# EAGLE design Venus (EAGLE 9.6.2)
COMPANY: ADAFRUIT INDUSTRIES; DRAWN: KTOWN; REV: B
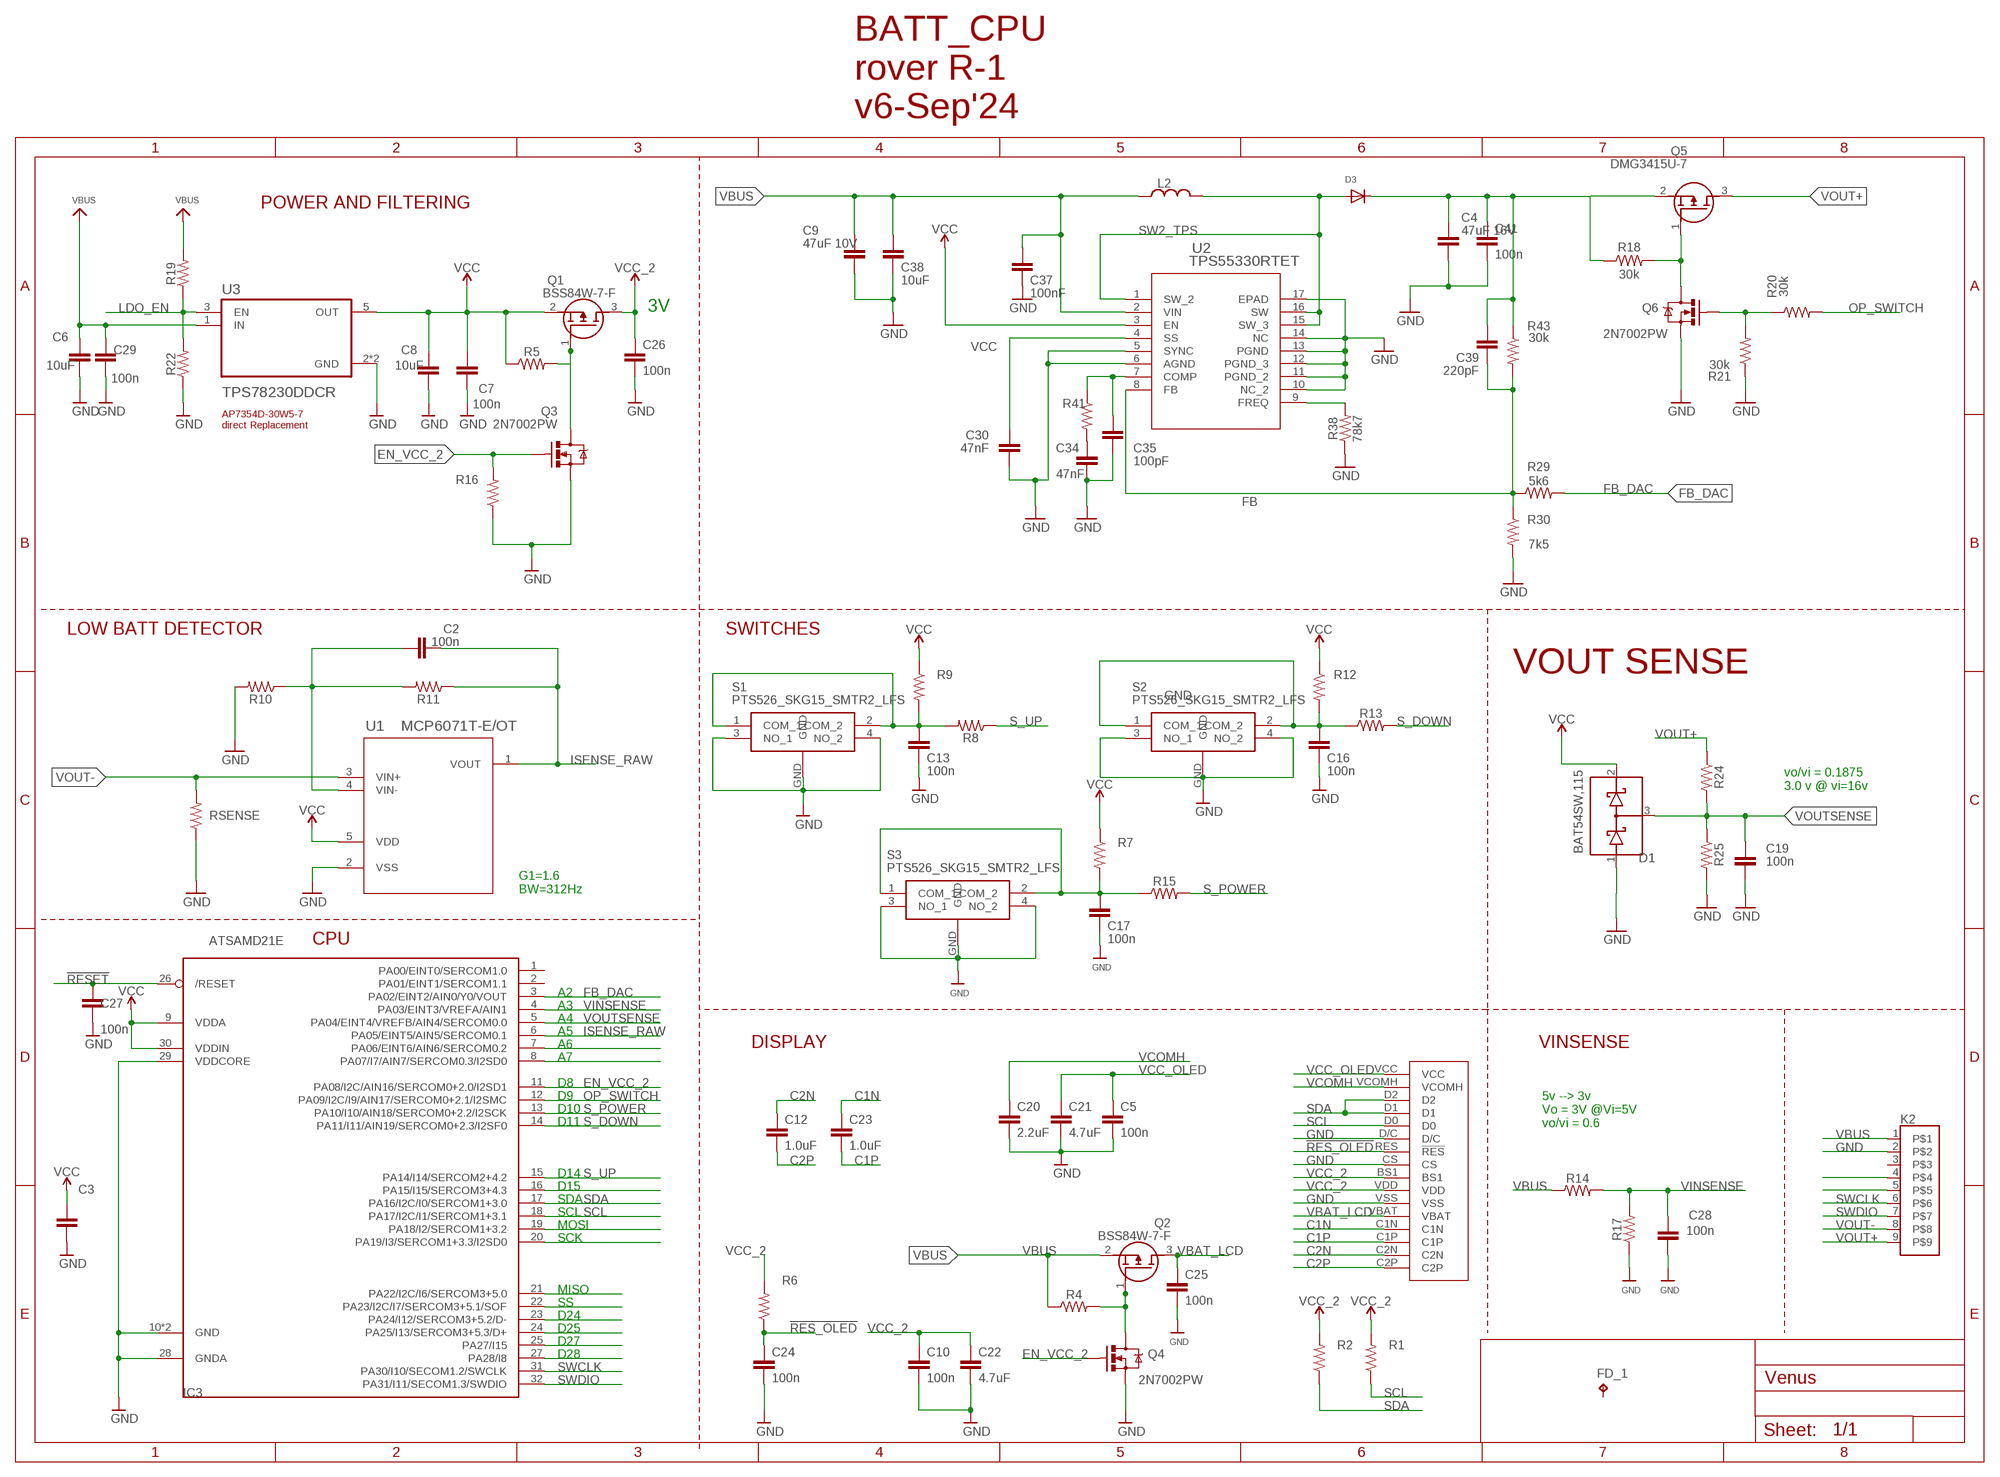
[diagram p0: schematic, sheet 1]

## Parts
C2  100n  0.1UF-0603-25V-(+80/-20%)  [0603]
C3  100n  0.1UF-0402-16V-10%  [0402]
C4  47uF 16V  C_CHIP-1206(3216-METRIC)  [CAPC3216X135]
C5  100n  0.1UF-0402-16V-10%  [0402]
C6  10uF  2.2UF-0603-10V-20%  [0603]
C7  100n  0.1UF-0402-16V-10%  [0402]
C8  10uF  2.2UF-0603-10V-20%  [0603]
C9  47uF 10V  C_CHIP-0805(2012-METRIC)  [CAPC2012X110]
C10  100n  0.1UF-0402-16V-10%  [0402]
C12  1.0uF  1.0UF-0402-16V-10%  [0402]
C13  100n  0.1UF-0402-16V-10%  [0402]
C16  100n  0.1UF-0402-16V-10%  [0402]
C17  100n  0.1UF-0402-16V-10%  [0402]
C19  100n  0.1UF-0603-25V-(+80/-20%)  [0603]
C20  2.2uF  2.2UF-0603-10V-20%  [0603]
C21  4.7uF  4.7UF0603  [0603]
C22  4.7uF  4.7UF0603  [0603]
C23  1.0uF  1.0UF-0402-16V-10%  [0402]
C24  100n  0.1UF-0402-16V-10%  [0402]
C25  100n  0.1UF-0402-16V-10%  [0402]
C26  100n  0.1UF-0402-16V-10%  [0402]
C27  100n  0.1UF-0402-16V-10%  [0402]
C28  100n  0.1UF-0402-16V-10%  [0402]
C29  100n  0.1UF-0402-16V-10%  [0402]
C30  47nF  47NF-0603-25V-5%  [0603]
C34  47nF  2.2NF/2200PF-0603-50V-10%  [0603]
C35  100pF  270PF-0603-50V-5%  [0603]
C37  100nF  0.1UF-0603-25V-(+80/-20%)  [0603]
C38  10uF  10UF-0805-10V-10%  [0805]
C39  220pF  270PF-0603-50V-5%  [0603]
C41  100n  0.1UF-0603-25V-(+80/-20%)  [0603]
D1  BAT54SW,115  [SOT65P210X110-3N]
D3  DIODESOD-123  [SOD-123]
FD_1  FD_1  TPTP06SQ  [TP06SQ]
IC3  ATSAMD21E  [QFN32_5MM]
K2  FLEX9_2MM  [FLEX9_2MM]
L2  L_CHIP-1206(3216-METRIC)  [INDC3216X190]
Q1  BSS84W-7-F  [SOT65P222X110-3N]
Q2  BSS84W-7-F  [SOT65P222X110-3N]
Q3  2N7002PW  MOSFET-NCHANNEL2N7002PW  [SOT323]
Q4  2N7002PW  MOSFET-NCHANNEL2N7002PW  [SOT323]
Q5  DMG3415U-7  SSM3J338R,LF  [SSM3J332RLFT]
Q6  2N7002PW  MOSFET-NCHANNEL2N7002PW  [SOT323]
R1  RESISTOR0402  [0402]
R2  RESISTOR0402  [0402]
R4  RESISTOR0402  [0402]
R5  RESISTOR0402  [0402]
R6  RESISTOR0402  [0402]
R7  RESISTOR0402  [0402]
R8  RESISTOR0402  [0402]
R9  RESISTOR0402  [0402]
R10  RESISTOR0402  [0402]
R11  RESISTOR0402  [0402]
R12  RESISTOR0402  [0402]
R13  RESISTOR0402  [0402]
R14  RESISTOR0402  [0402]
R15  RESISTOR0402  [0402]
R16  RESISTOR0402  [0402]
R17  RESISTOR0402  [0402]
R18  30k  RESISTOR0402  [0402]
R19  RESISTOR0402  [0402]
R20  30k  RESISTOR0402  [0402]
R21  30k  RESISTOR0402  [0402]
R22  RESISTOR0402  [0402]
R24  RESISTOR0402  [0402]
R25  RESISTOR0402  [0402]
R29  5k6  RESISTOR0402  [0402]
R30  7k5  RESISTOR0402  [0402]
R38  78k7  RESISTOR0402  [0402]
R41  RESISTOR0402  [0402]
R43  30k  RESISTOR0402  [0402]
RSENSE  RESISTOR1206  [1206]
S1  PTS526_SKG15_SMTR2_LFS  [PTS526SKG15SMTR2LFS]
S2  PTS526_SKG15_SMTR2_LFS  [PTS526SKG15SMTR2LFS]
S3  PTS526_SKG15_SMTR2_LFS  [PTS526SKG15SMTR2LFS]
U1  MCP6071T-E/OT  [SOT-23-5_MC_MCH]
U2  TPS55330RTET  [RTE16_1P66X1P66_TEX]
U3  TPS78230DDCR  [SOT95P280X110-5N]
U$30  72X40_OLED  [LCD_16_PINS]

## Nets
!RES_OLED: C24.1 R6.1 U$30.RES(!RES)
!RESET: C27.1 IC3.26(/RESET)
C1N: C23.1 U$30.C1N
C1P: C23.2 U$30.C1P
C2N: C12.1 U$30.C2N
C2P: C12.2 U$30.C2P
COMP_TPS: C35.2 R41.1 U2.7(COMP)
EN_VCC_2: IC3.11(PA08/I2C/AIN16/SERCOM0+2.0/I2SD1) Q3.1(G) Q4.1(G) R16.2
FB: C39.1 R29.1 R30.1 R43.2 U2.8(FB)
FB_DAC: IC3.3(PA02/EINT2/AIN0/Y0/VOUT) R29.2
FREQ_TPS: R38.2 U2.9(FREQ)
GND: C3.2 C4.2 C5.2 C6.2 C7.2 C8.2 C9.2 C10.2 C13.2 C16.2 C17.2 C19.2 C20.2 C21.2 C22.2 C24.2 C25.2 C26.2 C27.2 C28.2 C29.2 C30.2 C34.1 C35.1 C37.1 C38.1 C41.2 D1.1(A) IC3.10(GND) IC3.28(GNDA) IC3.29(VDDCORE) IC3.33(GND) K2.2 Q3.2(S) Q4.2(S) Q6.2(S) R10.2 R16.1 R17.1 R21.1 R22.1 R25.2 R30.2 R38.1 RSENSE.1 S1.3(NO_1) S1.4(NO_2) S1.GND S2.3(NO_1) S2.4(NO_2) S2.GND S3.3(NO_1) S3.4(NO_2) S3.GND U1.2(VSS) U2.5(SYNC) U2.6(AGND) U2.10(NC_2) U2.11(PGND_2) U2.12(PGND_3) U2.13(PGND) U2.14(NC) U2.17(EPAD) U3.2(GND) U3.4(GND) U$30.CS U$30.D/C U$30.VSS
ISENSE_RAW: C2.1 IC3.6(PA05/EINT5/AIN5/SERCOM0.1) R11.1 U1.1(VOUT)
LDO_EN: R19.1 R22.2 U3.3(EN)
N$1: C17.1 R7.2 R15.1 S3.1(COM_1) S3.2(COM_2)
N$2: C13.1 R8.2 R9.2 S1.1(COM_1) S1.2(COM_2)
N$3: C16.1 R12.2 R13.1 S2.1(COM_1) S2.2(COM_2)
N$4: Q2.1(G) Q4.3(D) R4.2
N$5: C2.2 R10.1 R11.2 U1.4(VIN-)
N$6: Q1.1(G) Q3.3(D) R5.2
N$7: Q6.1(G) R20.1 R21.2
N$8: K2.5
N$11: K2.4
N$12: Q5.1(G) Q6.3(D) R18.2
N$17: IC3.7(PA06/EINT6/AIN6/SERCOM0.2)
N$18: IC3.8(PA07/I7/AIN7/SERCOM0.3/I2SD0)
N$24: IC3.16(PA15/I15/SERCOM3+4.3)
N$27: IC3.19(PA18/I2/SERCOM1+3.2)
N$28: IC3.20(PA19/I3/SERCOM1+3.3/I2SD0)
N$29: IC3.21(PA22/I2C/I6/SERCOM3+5.0)
N$30: IC3.22(PA23/I2C/I7/SERCOM3+5.1/SOF)
N$31: IC3.23(PA24/I12/SERCOM3+5.2/D-)
N$32: IC3.24(PA25/I13/SERCOM3+5.3/D+)
N$33: IC3.25(PA27/I15)
N$34: IC3.27(PA28/I8)
N$35: C30.1 U2.4(SS)
N$43: C34.2 R41.2
OP_SWITCH: IC3.12(PA09/I2C/I9/AIN17/SERCOM0+2.1/I2SMC) R20.2
S_DOWN: IC3.14(PA11/I11/AIN19/SERCOM0+2.3/I2SF0) R13.2
S_POWER: IC3.13(PA10/I10/AIN18/SERCOM0+2.2/I2SCK) R15.2
S_UP: IC3.15(PA14/I14/SERCOM2+4.2) R8.1
SCL: IC3.18(PA17/I2C/I1/SERCOM1+3.1) R1.1 U$30.D0
SDA: IC3.17(PA16/I2C/I0/SERCOM1+3.0) R2.1 U$30.D1 U$30.D2
SW2_TPS: D3.A L2.2 U2.1(SW_2) U2.15(SW_3) U2.16(SW)
SWCLK: IC3.31(PA30/I10/SECOM1.2/SWCLK) K2.6
SWDIO: IC3.32(PA31/I11/SECOM1.3/SWDIO) K2.7
VBAT_LCD: C25.1 Q2.3(D) U$30.VBAT
VBUS: C6.1 C9.1 C29.1 C37.2 C38.2 K2.1 L2.1 Q2.2(S) R4.1 R14.1 R19.2 U2.2(VIN) U3.1(IN)
VCC: C3.1 C7.1 C8.1 D1.2(C) IC3.9(VDDA) IC3.30(VDDIN) Q1.2(S) R5.1 R7.1 R9.1 R12.1 U1.5(VDD) U2.3(EN) U3.5(OUT)
VCC_2: C10.1 C22.1 C26.1 Q1.3(D) R1.2 R2.2 R6.2 U$30.BS1 U$30.VDD
VCC_OLED: C5.1 C21.1 U$30.VCC
VCOMH: C20.1 U$30.VCOMH
VINSENSE: C28.1 IC3.4(PA03/EINT3/VREFA/AIN1) R14.2 R17.2
VOUT+: K2.9 Q5.3(D) R24.1
VOUT-: K2.8 RSENSE.2 U1.3(VIN+)
VOUTSENSE: C19.1 D1.3(A-C) IC3.5(PA04/EINT4/VREFB/AIN4/SERCOM0.0) R24.2 R25.1
VSOURCE: C4.1 C39.2 C41.1 D3.C Q5.2(S) R18.1 R43.1
Unconnected: FD_1.TP IC3.1(PA00/EINT0/SERCOM1.0) IC3.2(PA01/EINT1/SERCOM1.1) K2.3

## Notes on the sheet
- BATT_CPU
  rover R-1
  v6-Sep'24
- POWER AND FILTERING
- 3V
- AP7354D-30W5-7 
  direct Replacement
- LOW BATT DETECTOR | SWITCHES
- VOUT SENSE
- vo/vi = 0.1875
  3.0 v @ vi=16v
- G1=1.6
  BW=312Hz
- CPU
- A2
- A3
- A4
- A5
- A6 | DISPLAY | VINSENSE
- A7
- D8
- D9
- D10
- D11
- 5v --> 3v
  Vo = 3V @Vi=5V
  vo/vi = 0.6
- D14
- D15
- SDA
- SCL
- MOSI
- SCK
- MISO
- SS
- D24
- D25
- D27
- D28

## Library data of the parts
C2 C19 C37 C41 = SparkFun-Capacitors:0.1UF: 0.1µF ceramic capacitors A capacitor is a passive two-terminal electrical component used to store electrical energy temporarily in an electric field.; PROD_ID: CAP-00810; VALUE: 0.1uF
C3 C5 C7 C10 C13 C16 C17 C24-C29 = SparkFun-Capacitors:0.1UF: 0.1µF ceramic capacitors A capacitor is a passive two-terminal electrical component used to store electrical energy temporarily in an electric field.; PROD_ID: CAP-12416; VALUE: 0.1uF
C4 C9 = Capacitor:C: Capacitor - Generic; CATEGORY: Capacitor
C6 C8 = SparkFun-Capacitors:2.2UF: 2.2µF ceramic capacitors A capacitor is a passive two-terminal electrical component used to store electrical energy temporarily in an electric field.; PROD_ID: CAP-07888; VALUE: 2.2uF
C12 C23 = SparkFun-Capacitors:1.0UF: 1µF ceramic capacitors A capacitor is a passive two-terminal electrical component used to store electrical energy temporarily in an electric field.; PROD_ID: CAP-12417
C20 = SparkFun-Capacitors:2.2UF: 2.2µF ceramic capacitors A capacitor is a passive two-terminal electrical component used to store electrical energy temporarily in an electric field.; PROD_ID: CAP-07888
C21 C22 = SparkFun-Capacitors:4.7UF: 4.7µF ceramic capacitors A capacitor is a passive two-terminal electrical component used to store electrical energy temporarily in an electric field.; PROD_ID: CAP-08280
C30 = SparkFun-Capacitors:47NF: 47nF ceramic capacitors A capacitor is a passive two-terminal electrical component used to store electrical energy temporarily in an electric field.; PROD_ID: CAP-08605
C34 = SparkFun-Capacitors:2.2NF/2200PF: 2.2nF/2,200pF ceramic capacitors A capacitor is a passive two-terminal electrical component used to store electrical energy temporarily in an electric field.; PROD_ID: CAP-07877; VALUE: 2.2nF
C35 C39 = SparkFun-Capacitors:270PF: 270pF/0.27nF ceramic capacitors A capacitor is a passive two-terminal electrical component used to store electrical energy temporarily in an electric field.; PROD_ID: CAP-13339; VALUE: 270PF
C38 = SparkFun-Capacitors:10UF: 10.0µF ceramic capacitors A capacitor is a passive two-terminal electrical component used to store electrical energy temporarily in an electric field.; PROD_ID: CAP-11330
D1 = BAT54SW_115:BAT54SW,115: BAT54W Series 30 V 600 mA SMT Schottky Barrier Double Diode -SOT-323 Check availability <https://pricing.snapeda.com/parts/BAT54SW%2C115/Nexperia%20USA%20Inc./view-part?ref=eda>; AVAILABILITY: In Stock; DESCRIPTION: Diode Array 1 Pair Series Connection Schottky 30 V 200mA (DC) Surface Mount SC-70, SOT-323; MF: Nexperia USA Inc.; MP: BAT54SW,115; PACKAGE: SOT-323 Nexperia USA Inc.; PRICE: None; PURCHASE-URL: https://pricing.snapeda.com/search/part/BAT54SW,115/?ref=eda
D3 = adafruit:DIODE: Diode SMADIODE - SMA Surface Mount Package 20V 1A Schottky Diode Digikey: 641-1014-6-ND DO-1N4148 - Through Hole Small Current Diode SOD-123 20V 1 A (.5mV Vf) Schottky Diode - Digikey: MBRX120TPMSCT-ND SOD-323 10V 570mA (.38mV Vf, 3ns) Schottky Diode - Digikey: ZLLS410CT-ND SOD-523 30V 30mA Schottky Diode (RB751S-40TE61) - Digikey: RB751S-40TE61CT-ND SOT23-R/W - SOT23 Package (R = Solder Paste/Reflow Ovens, W = Hand-Soldering) BAT54Film 40V 300mA - Digikey: 497-7162-1-ND
FD_1 = testpad:TP: Test pad
IC3 = microbuilder:ATSAMD21E
K2 = Flex_3mm:FLEX9_2MM
L2 = Inductor:L: Inductor Fixed - Generic; CATEGORY: Inductor; SUB-CATEGORY: Fixed
Q1 Q2 = BSS84W-7-F:BSS84W-7-F: Lattice Source: Datasheet <https://www.diodes.com/assets/Datasheets/BSS84W.pdf>; DESCRIPTION: Lattice; HEIGHT: 1.1mm; MANUFACTURER_NAME: Lattice Semiconductor; MANUFACTURER_PART_NUMBER: BSS84W-7-F; MOUSER_PART_NUMBER: N/A; MOUSER_PRICE-STOCK: https://www.mouser.com/Search/Refine.aspx?Keyword=N%2FA
Q3 Q4 Q6 = SparkFun-DiscreteSemi:MOSFET-NCHANNEL: Common NMOSFET Parts MFG P/N Store ID Prod ID FDD8780 TRANS-09984 SI7820DN TRANS-11055 FDS6630A IC-08089 2N7002PW TRANS-11151 FQP30N06L COM-10213 TRANS-10060 BSS123LT1G TRANS-08345 BSS138 TRANS-00830 BS170 2N7000; PROD_ID: TRANS-11151
Q5 = SSM3J338R_LF:SSM3J338R,LF: MOSFET Small-signal MOSFET Vdss= -12V, ID= -6A Source: Datasheet <http://toshiba.semicon-storage.com/info/docget.jsp?did=30384&prodName=SSM3J338R>; ARROW_PART_NUMBER: SSM3J338R,LF; ARROW_PRICE-STOCK: https://www.arrow.com/en/products/ssm3j338rlf/toshiba?region=nac; DESCRIPTION: MOSFET Small-signal MOSFET Vdss= -12V, ID= -6A; HEIGHT: mm; MANUFACTURER_NAME: Toshiba; MANUFACTURER_PART_NUMBER: SSM3J338R,LF; MOUSER_PART_NUMBER: 757-SSM3J338RLF; MOUSER_PRICE-STOCK: https://www.mouser.co.uk/ProductDetail/Toshiba/SSM3J338RLF?qs=lhkzy8lC%252BSvURFM9ZjmJSw%3D%3D
R1 R2 R4-R22 R24 R25 R29 R30 R38 R41 R43 RSENSE = SparkFun-Resistors:RESISTOR: Generic Resistor Package
S1-S3 = PTS526_SKG15_SMTR2_LFS:PTS526_SKG15_SMTR2_LFS: Tact 5.2 x 5.2, 1.5 mm H, 260gf, G leads, Ground pin, metal actuator Source: Datasheet <https://www.arrow.com/en/products/pts526-skg15-smtr2-lfs/ck>; ARROW_PART_NUMBER: PTS526 SKG15 SMTR2 LFS; ARROW_PRICE-STOCK: https://www.arrow.com/en/products/pts526-skg15-smtr2-lfs/ck?region=nac; DESCRIPTION: Tact 5.2 x 5.2, 1.5 mm H, 260gf, G leads, Ground pin, metal actuator; HEIGHT: 1.6mm; MANUFACTURER_NAME: C & K COMPONENTS; MANUFACTURER_PART_NUMBER: PTS526 SKG15 SMTR2 LFS; MOUSER_PART_NUMBER: 611-PTS526SKG15SMR2L; MOUSER_PRICE-STOCK: https://www.mouser.co.uk/ProductDetail/CK/PTS526-SKG15-SMTR2-LFS?qs=UXgszm6BlbEc7nn5s4cd2Q%3D%3D
U1 = MCP6071:MCP6071T-E/OT; BUILT_BY: EMA_Jessica; COPYRIGHT: Copyright (C) 2018 Accelerated Designs. All rights reserved; MANUFACTURER_PART_NUMBER: MCP6071T-E/OT; SOURCELIBRARY: Microchip_2019-08-23_21; VENDOR: Microchip
U2 = TPS55330:TPS55330RTET; BUILT_BY: EMA_UL_Team; MANUFACTURER_PART_NUMBER: TPS55330RTET; SOURCELIBRARY: TI_2015-1-5; VENDOR: Texas Instruments
U3 = TPS78230DDCR:TPS78230DDCR: Check prices <https://pricing.snapeda.com/parts/TPS78230DDCR/Texas%20Instruments/view-part?ref=eda>; AVAILABILITY: Good; DESCRIPTION: 150-mA, nano-IQ, low-dropout voltage regulator with enable from -40C to +125C 5-SOT-23-THIN -40 to 125; MF: Texas Instruments; MP: TPS78230DDCR; PACKAGE: SOT-23-THN-5 Texas Instruments; PRICE: None; PURCHASE-URL: https://pricing.snapeda.com/search/part/TPS78230DDCR/?ref=eda
U$30 = OLED 66 64x48:72X40_OLED; SPICEPREFIX: X

## Net classes
2 gnd: width 0.305 mm, drill 0.483 mm, clearance 0.203 mm

## Board
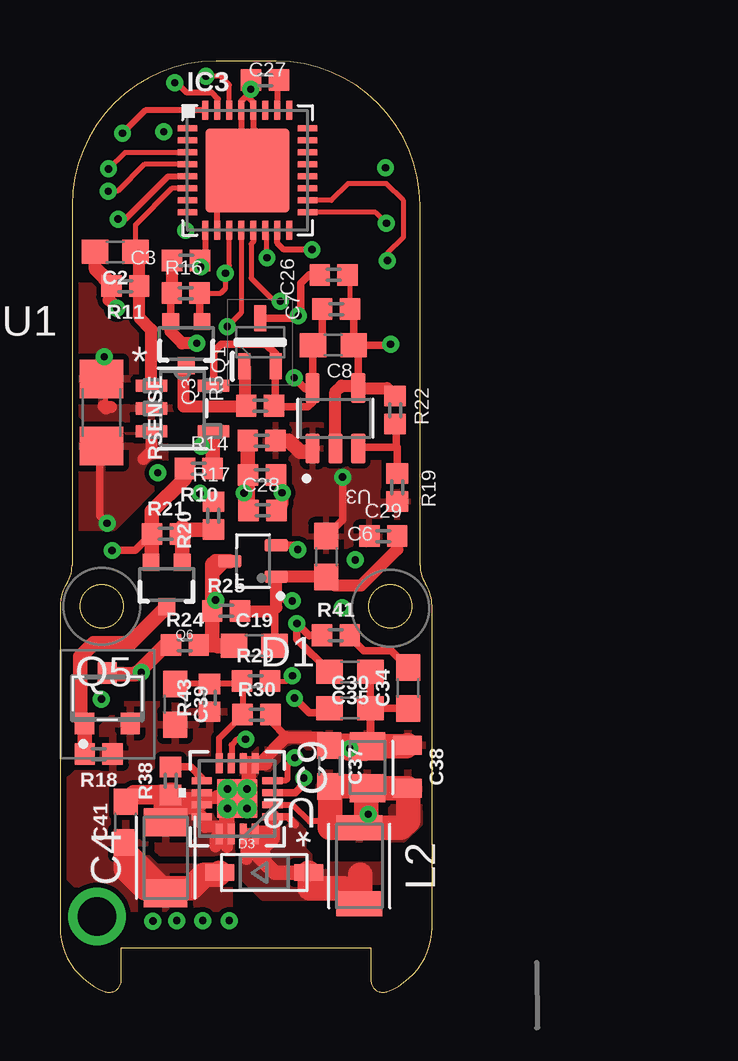
[diagram p1: board, top side]
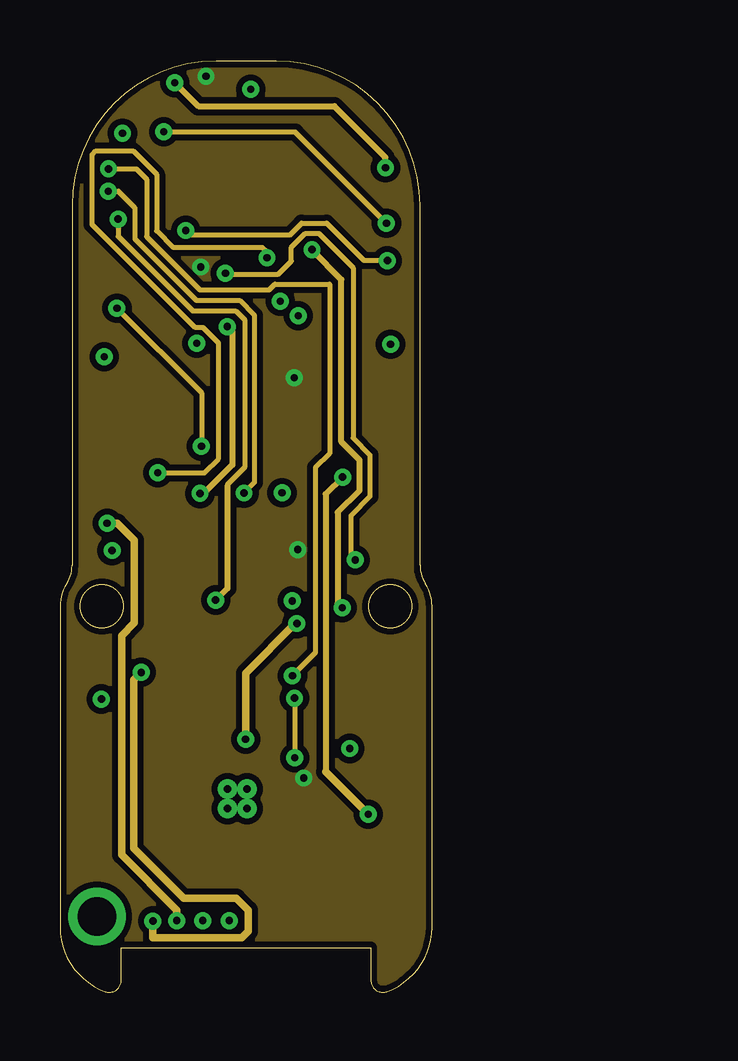
[diagram p2: board, inner layer Route2]
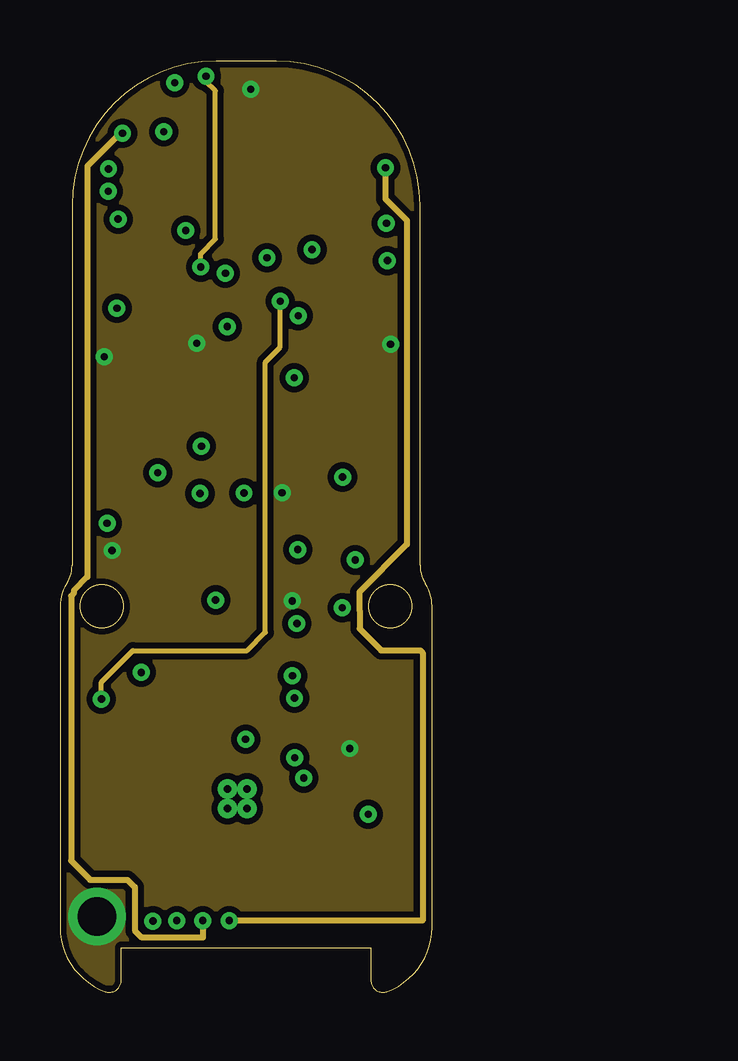
[diagram p3: board, inner layer GND]
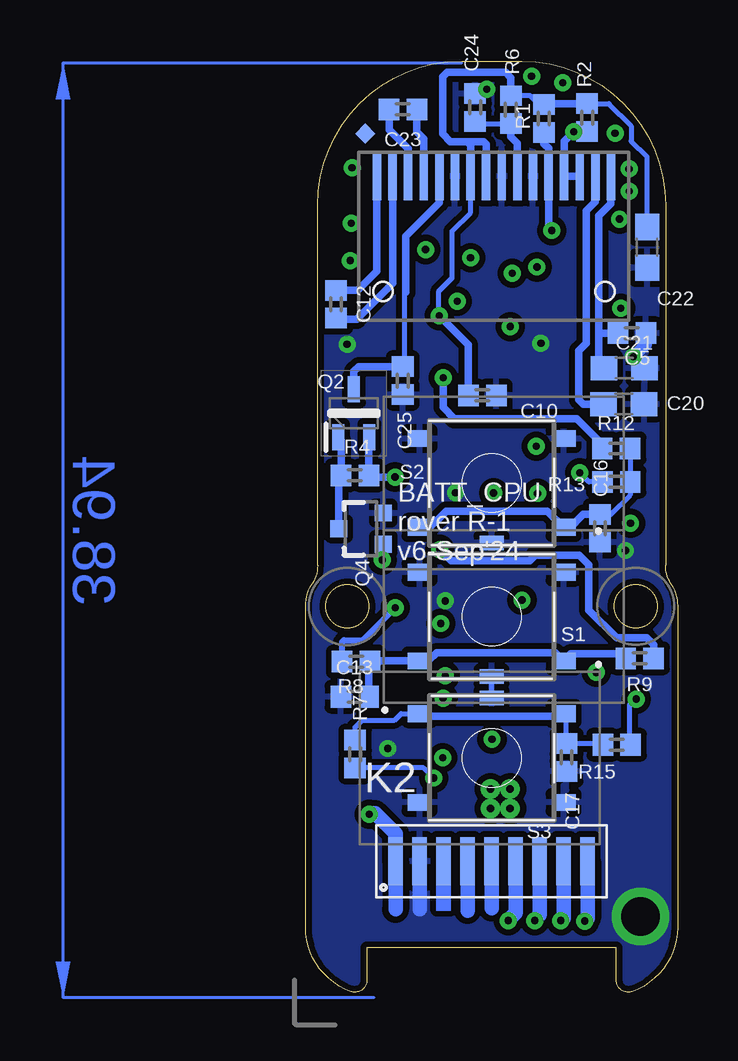
[diagram p4: board, bottom side, seen from below]

Size 15.5 x 38.8 mm. Coordinates in mm from the lower left corner, seen from the top.
Outline: 0,2.71 arc70 1.88,0.03 arc110 2.55,0.5 2.55,1.86 12.95,1.86 12.95,0.5 arc110 13.62,0.03 arc70 15.5,2.71 15.5,16.08 arc33 15.23,17.02 arc-33 15,17.79 15,32.79 arc90 9,38.79 6.5,38.79 arc90 0.5,32.79 0.5,17.79 arc-33 0.28,17.02 arc33 0,16.08 0,2.71
Outline: circle at 1.74,16.08 radius 0.9
Outline: circle at 13.76,16.08 radius 0.9
Copper layers (1+2*15+16): Top 0.035mm / dielectric 1.5mm / Route2 0.035mm / dielectric 0.15mm / GND 0.035mm / dielectric 0.2mm / Bottom 0.035mm
Design rules "adafruit *": minimum track width 8mil, minimum drill 0.25mm, track to track 8mil, track to pad 8mil, pad to pad 8mil, via to via 8mil, smd to smd 5mil, copper to edge 10mil, drill to drill 8mil, minimum pad ring 10mil, minimum via ring 8mil, stop-mask expansion 2mil, vias tented up to drill 20mil, thermal gap 10mil

### Footprints (pad centres in the part's own frame; a part is rotated, then mirrored left to right if it is on the bottom)
0603 = smd 1.1 x 1: 1 -0.85,0; 2 0.85,0
0402 = smd 0.85 x 0.9: 1 -0.58,0; 2 0.58,0
CAPC3216X135 = smd 1.165 x 1.815: 1 -1.475,0; 2 1.475,0
CAPC2012X110 = smd 1.165 x 1.465: 1 -0.875,0; 2 0.875,0
0805 = smd 0.8 x 1.2: 1 -0.9,0; 2 0.9,0
SOT65P210X110-3N = smd 0.99 x 0.5: 1 -0.97,0.65; 2 -0.97,-0.65; 3 0.97,0
SOD-123 = smd 1.2 x 0.7: A 1.85,0; C -1.85,0
TP06SQ = smd 0.6 x 0.6: TP 0,0
QFN32_5MM = smd 0.8 x 0.25: 1 -2.5,1.75; 2 -2.5,1.25; 3 -2.5,0.75; 4 -2.5,0.25; 5 -2.5,-0.25; 6 -2.5,-0.75; 7 -2.5,-1.25; 8 -2.5,-1.75; 17 2.5,-1.75; 18 2.5,-1.25; 19 2.5,-0.75; 20 2.5,-0.25; 21 2.5,0.25; 22 2.5,0.75; 23 2.5,1.25; 24 2.5,1.75 | smd 0.25 x 0.8: 9 -1.75,-2.5; 10 -1.25,-2.5; 11 -0.75,-2.5; 12 -0.25,-2.5; 13 0.25,-2.5; 14 0.75,-2.5; 15 1.25,-2.5; 16 1.75,-2.5; 25 1.75,2.5; 26 1.25,2.5; 27 0.75,2.5; 28 0.25,2.5; 29 -0.25,2.5; 30 -0.75,2.5; 31 -1.25,2.5; 32 -1.75,2.5 | smd 3.5 x 3.5: 33 0,0
FLEX9_2MM = smd 0.6 x 2: 1 0.8,1.5; 2 1.8,1.5; 3 2.8,1.5; 4 3.8,1.5; 5 4.8,1.5; 6 5.8,1.5; 7 6.8,1.5; 8 7.8,1.5; 9 8.8,1.5
INDC3216X190 = smd 1.043 x 1.91: 1 -1.584,0; 2 1.584,0
SOT65P222X110-3N = smd 1.1 x 0.5: 1 -1,0.65; 2 -1,-0.65; 3 1,0
SOT323 = smd 0.7 x 0.7: 1 -0.65,-0.925; 2 0.65,-0.925; 3 0,0.925
SSM3J332RLFT = smd 0.8 x 0.9: 1 -0.95,-1.05; 2 0.95,-1.05; 3 0,1.05
1206 = smd 1.6 x 1.8: 1 -1.4,0; 2 1.4,0
PTS526SKG15SMTR2LFS = smd 1 x 0.7: 1 -3,1.85; 2 3,1.85; 3 -3,-1.85; 4 3,-1.85 | smd 1 x 0.6: GND 0,2.5
SOT-23-5_MC_MCH = smd 1.31 x 0.508: 1 -1.295,0.95; 2 -1.295,0; 3 -1.295,-0.95; 4 1.295,-0.95; 5 1.295,0.95
RTE16_1P66X1P66_TEX = smd 0.85 x 0.28: 1 -1.475,0.75; 2 -1.475,0.25; 3 -1.475,-0.25; 4 -1.475,-0.75; 9 1.475,-0.75; 10 1.475,-0.25; 11 1.475,0.25; 12 1.475,0.75 | smd 0.28 x 0.85: 5 -0.75,-1.475; 6 -0.25,-1.475; 7 0.25,-1.475; 8 0.75,-1.475; 13 0.75,1.475; 14 0.25,1.475; 15 -0.25,1.475; 16 -0.75,1.475 | smd 1.66 x 1.6: 17 0,0 | drill 0.305 pad 0.508: V -0.406,-0.406; V_1 -0.406,0.406; V_2 0.406,-0.406; V_3 0.406,0.406
SOT95P280X110-5N = smd 1.25 x 0.59: 1 -1.255,0.95; 2 -1.255,0; 3 -1.255,-0.95; 4 1.255,-0.95; 5 1.255,0.95
LCD_16_PINS = smd 0.35 x 2: BS1 4.55,1; C1N 1.95,1; C1P 1.3,1; C2N 0.65,1; C2P 0,1; CS 5.2,1; D0 7.15,1; D1 7.8,1; D2 8.45,1; D/C 6.5,1; RES 5.85,1; VBAT 2.6,1; VCC 9.75,1; VCOMH 9.1,1; VDD 3.9,1; VSS 3.25,1

### Placement (x,y rotation side)
C2  2.3,30.85 180 top
C3  5.25,30.49 180 top
C4  4.4,5.6 90 top
C5  1.9,27.46 0 bottom
C6  11.09,18.15 270 top
C7  11.51,28.46 0 top
C8  11.39,26.97 0 top
C9  12.81,9.36 90 top
C10  8.13,24.86 0 bottom
C12  14.23,28.66 90 bottom
C13  13.45,12.31 180 bottom
C16  3.23,19.33 270 bottom
C17  4.63,9.78 270 bottom
C19  8.09,14.44 0 top
C20  2.24,24.5 0 bottom
C21  2.22,26 0 bottom
C22  1.27,31.03 270 bottom
C23  11.44,36.78 180 bottom
C24  8.43,36.86 90 bottom
C25  11.45,25.48 270 bottom
C26  11.4,29.88 0 top
C27  8.54,38 180 top
C28  8.44,20.07 0 top
C29  13.47,19 0 top
C30  12.08,11.83 0 top
C34  14.5,12.67 90 top
C35  12.08,13.35 180 top
C37  11.22,9.42 270 top
C38  14.48,9.39 270 top
C39  4.79,11.99 270 top
C41  2.74,7.08 90 top
D1  8.04,17.96 180 top
D3  8.51,4.98 0 top
FD_1  13.01,35.77 45 bottom
IC3  7.81,34.24 0 top
K2  12.55,3.96 0 bottom
L2  12.47,5.26 270 top
Q1  8.33,27.08 90 top
Q2  13.49,24.12 90 bottom
Q3  5.27,27.02 180 top
Q4  13.19,19.31 90 bottom
Q5  1.97,12.24 0 top
Q6  4.44,16.98 180 top
R1  5.57,36.4 90 bottom
R2  3.77,36.44 90 bottom
R4  13.44,21.53 180 bottom
R5  8.34,24.44 180 top
R6  6.94,36.77 90 bottom
R7  13.43,9.92 90 bottom
R8  13.4,13.77 0 bottom
R9  1.58,13.91 180 bottom
R10  5.78,21.81 180 top
R11  2.72,29.42 180 top
R12  2.56,22.65 0 bottom
R13  2.55,21.26 180 bottom
R14  8.4,22.98 180 top
R15  2.53,10.31 0 bottom
R16  5.23,29.13 0 top
R17  8.41,21.54 180 top
R18  1.61,9.92 180 top
R19  14.05,21.03 270 top
R20  6.39,19.85 90 top
R21  4.41,19.09 0 top
R22  13.96,24.25 270 top
R24  5.2,14.46 0 top
R25  6.92,15.88 0 top
R29  8.16,12.96 0 top
R30  8.19,11.56 0 top
R38  4.61,8.8 90 top
R41  11.49,14.87 0 top
R43  6.23,12.26 90 top
RSENSE  1.73,24.15 270 top
S1  7.74,15.65 180 bottom
S2  7.74,21.22 180 bottom
S3  7.74,9.76 0 bottom
U1  5.1,24.32 0 top
U2  7.38,8.06 180 top
U3  11.48,23.91 90 top
U$30  12.53,33 0 bottom

### Tracks (layer width: path | path; a pad name or v marks a point on that pad's centre or on a via)
!RES_OLED
  Bottom 0.203: C24.1 8.34,36.19 R6.1
  Bottom 0.305: U$30.RES 6.68,35.38 6.94,35.65 R6.1
!RESET
  Top 0.254: C27.1 9.06,37.94 IC3.26
C1N
  Bottom 0.305: C23.1 10.86,35.85 10.8,35.79 10.58,35.57 U$30.C1N
C1P
  Bottom 0.305: C23.2 12.02,35.94 11.23,35.15 U$30.C1P
C2N
  Bottom 0.305: C12.1 14.19,28.04 13.37,28.04 11.88,29.54 U$30.C2N
C2P
  Bottom 0.305: C12.2 13.33,29.24 12.53,30.04 U$30.C2P
COMP_TPS  (via drill 0.3)
  Top 0.254: U2.7 7.15,9.56 7.15,10.29 7.4,10.53 v7.73,10.53
  Top 0.305: R41.1 10.39,14.87 10.38,14.86 v9.87,15.36 9.87,14.72 C35.2
  Route2 0.305: 7.73,10.77 v7.73,10.53 7.73,13.29 9.8,15.36 v9.87,15.36
EN_VCC_2  (via drill 0.3)
  Top 0.203: IC3.11 7.06,30.27 6.89,30.1 v6.89,29.95 6.89,29.32 6.7,29.13 R16.2
  Top 0.305: R16.2 5.81,28.05 Q3.1
  Route2 0.203: v12.3,18.01 12.12,18.19 12.12,19.86 12.91,20.65 12.91,22.38 12.21,23.09 12.21,30.18 10.78,31.61 10.22,31.61 9.64,31.03 9.64,30.46 9.1,29.92 6.89,29.92 v6.89,29.95
  Bottom 0.305: Q4.1 12.3,18.63 v12.3,18.01
FB
  Top 0.254: U2.8 6.63,10.58 R30.1 7.61,12.93 R29.1 7.46,12.84 R43.2 C39.1
FB_DAC  (via drill 0.3)
  Top 0.203: R29.2 9.46,12.96 v9.68,13.19 | v2.02,34.3 2.71,34.99 IC3.3
  Route2 0.203: v2.02,34.3 3.18,34.3 3.61,33.87 3.61,31.49 5.83,29.26 8.71,29.26 8.95,29.5 11.22,29.5 11.23,29.49 11.23,22.45 10.64,21.85 10.64,14.15 v9.68,13.19
FREQ_TPS
  Top 0.305: U2.9 5.91,8.92 5.44,9.38 R38.2
GND  (via drill 0.3, 1.6 pad 2)
  Top 0.203: U2.10 5.91,8.29 5.9,8.28 | U2.12 5.91,7.33 5.9,7.34 | 8.06,36 8.07,35.99 8.46,35.6 | 8.46,35.6 9.02,35.6 | C7.2 12.09,29.78 C26.2 | 6.57,33.76 7.33,33.76 IC3.33 8.2,34.24 8.46,34.5 8.46,35.6 | C27.2 7.96,37.64 v7.95,37.63 | C9.2 13.39,10.24 | U2.14 6.89,6.83 6.89,6.93 | U2.14 7.01,6.71 7.01,6.89 | 6.96,6.83 7.13,6.66 U2.14 | 1.81,24.42 2.08,24.42 2.13,24.37 | 1.91,24.32 1.91,25.37 RSENSE.1
  Top 0.254: IC3.10 6.56,33.75 | 7.56,35.3 IC3.29 7.56,37.12 7.79,37.35 | U2.6 7.87,9.54 | 7.94,35.68 8.07,35.81 8.07,35.99 | 8.06,36 IC3.28 8.06,37.07 7.79,37.35 | C27.2 7.83,37.87 7.83,37.39 7.79,37.35
  Top 0.305: U3.4 12.42,25.18 12.42,26.79 C8.2 | C7.2 12.24,28.31 C8.2 | R16.1 4.62,29.09 Q3.2 | C35.1 C30.2 | C34.1 C30.2 | C30.2 12.95,11.81 12.95,10.38 C9.2 | C19.2 8.94,15.78 8.85,15.87 | C30.2 12.93,10.37 12.71,10.15 v12.07,10.15 | D1.1 9.01,16.72 9.43,16.3 v9.68,16.3 | R30.2 8.77,11.3 9.44,10.64 9.47,10.6 | R17.1 9.25,21.28 v9.25,20.81 | C8.2 13.74,26.97 v13.77,26.99 | R21.1 3.14,18.41 v2.17,18.41 | 6.56,33.75 6.57,33.76 | 7.94,35.68 7.56,35.3 | 7.87,9.54 U2.5 8.34,9.54
  Top 0.508: U2.11 6.19,8.09 | 6.96,6.04 6.96,6.83 | U2.13 6.47,6.43 6.47,6.07 | U2.17 7.21,8.06 6.89,7.74 6.89,6.93 | U2.17 7.36,8.08 4.75,8.08 R38.1 5.18,7.65 5.57,7.65 U2.12 5.91,7.01 6.03,6.89 7.01,6.89 7.01,7.69 U2.17 | U2.17 7.27,8.17 6.55,8.17 | U2.17 7.69,8.37 | 7.84,8.33 7.57,8.06 U2.17 | C37.1 10.89,10.6 9.47,10.6 | 8.34,9.54 9.44,10.64 | C29.2 14.05,18.45 12.54,16.94 11.45,16.94 C6.2 11.08,17.31 D1.1 9.01,16.03 8.85,15.87 R25.2 | v9.25,20.81 9.25,20.3 C28.2 | U3.2 11.48,25.02 11.73,25.27 12.32,25.27 U3.4 13.63,25.17 R22.1 | 2.13,24.37 1.86,24.37 | 1.81,24.42 1.86,24.37 | 1.86,24.37 1.91,24.32 | Q3.2 4.6,27.93 4.6,27.53 5.09,27.03 v5.69,27.03 | C3.2 4.65,30.47 R16.1
  Top 0.61: Q6.2 3.83,17.95 R21.1 3.83,20.03 5.2,21.4 R10.2 | U2.17 7.87,8.55 7.87,9.54 8.55,9.54
  Top 0.813: R38.1 3.09,8.22 2.8,7.93 C41.2
  Top 1.016: R38.1 4.4,8.01 C4.2 | C37.1 11.95,10.27 v12.07,10.15 12.73,10.15 C9.2 | 13.39,10.24 14.43,10.24 C38.1
  Bottom 0.203: C24.2 8.13,37.44 v7.95,37.63 | S3.GND S1.GND
  Bottom 0.508: v1.84,26.47 1.32,26.99 C5.2
  Bottom 0.61: K2.2 10.75,3.45
  other vias: 1.54,3.15
  pour Bottom (isolate 0.254): -1.74,39.03 14,39.03 16.01,37.02 16.01,-1.72 -4.51,-1.72 -4.51,36.26
  pour GND (isolate 0.254): -4.68,36.15 -1.18,39.65 12.75,39.65 16.01,36.39 16.01,-1.71 -4.68,-1.71
  pour Top: 7.65,5.8 4.21,5.8 4.09,5.92 4.09,8.61 4.3,8.82 6.69,8.82 6.89,9.02 7.73,9.02 7.73,10.08 8.76,10.08 9.44,10.76 15.16,10.76 15.16,10.16 9.54,10.16 8.64,9.26 8.64,7.48 7.65,7.48
  pour Top: 0.59,29.42 1.92,29.42 3.13,28.21 3.13,24.89 3.25,24.77 4.51,24.77 4.64,24.64 4.64,23.81 1.16,23.81 0.59,24.38
ISENSE_RAW
  Top 0.203: C2.1 3.15,31.98 4.67,33.49 IC3.6
  Top 0.508: U1.1 3.81,27.61 3.3,28.11 R11.1 3.3,30.7 C2.1
LDO_EN
  Top 0.305: R22.2 14,23.63 14,22.71 | R19.1 14.05,22.71 14,22.71 | U3.3 12.48,22.71 14,22.71
N$1
  Bottom 0.203: R7.2 13.43,11.04 13.14,11.33 11.79,11.33 11.52,11.61 S3.1 | S3.2 4.63,11.49 C17.1 3.16,10.36 R15.1
  Bottom 0.305: S3.1 10.64,11.5 4.85,11.5 S3.2
N$2
  Bottom 0.203: R8.2 12.87,13.72
  Bottom 0.305: 12.87,13.72 C13.1 | R9.2 2.35,14.09 4.45,14.09 S1.1 5.1,14.15 10.03,14.15 10.38,13.8 S1.2 12.39,13.8 12.43,13.77 R8.2
N$3
  Bottom 0.203: C16.1 2.78,19.91 1.97,20.71 R13.1 R12.2
  Bottom 0.305: 10.95,19.37 S2.2 10.32,19.37 9.64,20.05 5.42,20.05 S2.1 4.64,19.27 4.56,19.27 3.93,19.91 C16.1
N$4
  Bottom 0.305: Q2.1 14.02,23 R4.2 14.12,21.44 Q4.3
N$5  (via drill 0.3)
  Top 0.305: U1.4 6.4,23.26 v5.89,22.75
  Top 0.508: R11.2 1.45,30.11 C2.2 1.45,30.23 2.02,29.66 2.02,28.85 v2.37,28.5
  Top 0.61: R10.1 6.36,23.37 U1.4
  Route2 0.203: v5.89,22.75 v5.9,22.76 5.9,24.97 v2.37,28.5
N$6
  Top 0.508: Q1.1 7.69,24.51 R5.2 7.72,24.39 5.15,24.39 5.15,25.98 Q3.3
N$7
  Top 0.61: Q6.1 5.09,18.99 | 5.09,18.99 5.09,19.38 5.21,19.26 6.3,19.26 6.31,19.27 R20.1 | 5.09,18.99 R21.2
N$8
  Bottom 0.61: K2.5 7.75,3.5
N$11
  Bottom 0.61: K2.4 8.75,3.4
N$12
  Top 0.61: R18.2 Q5.1 0.84,11.37 0.84,13.99 1.41,14.55 2.93,14.55 Q6.3
N$35  (via drill 0.3)
  Top 0.254: v9.78,9.76 9.47,9.45 9.47,8.89 9.4,8.81 U2.4
  Top 0.305: v9.77,12.26 10.39,11.64 11.03,11.64 C30.1
  Route2 0.203: v9.77,12.26 9.77,9.78 v9.78,9.76
N$43
  Top 0.305: C34.2 13.8,14.22 12.66,14.22 12.07,14.81 R41.2
OP_SWITCH  (via drill 0.3)
  Top 0.203: v6.97,27.73 7.55,28.31 7.55,31.72 IC3.12
  Top 0.254: R20.2 6.18,20.43 v5.83,20.78
  Route2 0.254: v5.83,20.78 6,20.78 7.19,21.97 7.19,27.52 v6.97,27.73
S_DOWN  (via drill 0.3)
  Top 0.203: IC3.14 8.59,31.72 8.59,30.64 v8.63,30.6
  Route2 0.203: v8.63,30.6 8.63,30.83 8.44,31.02 4.72,31.02 4.02,31.72 4.02,34.07 3.04,35.05 1.5,35.05 1.34,34.9 1.34,31.99 5.64,27.69 5.97,27.69 6.61,27.05 6.61,22.23 6.02,21.64 v4.08,21.64
  Bottom 0.203: R13.2 3.7,21.26 v4.08,21.64
S_POWER  (via drill 0.3)
  Top 0.203: IC3.13 8.07,31.28 7.97,31.18 7.97,29.76 8.83,28.9 9.08,28.9 v9.18,28.8
  GND 0.203: v1.73,12.21 1.73,12.92 3.04,14.23 7.79,14.23 8.55,15 8.55,26.26 9.18,26.88 v9.18,28.8
  Bottom 0.203: v1.73,12.21 1.76,12.21 2,11.97 2,10.39 1.95,10.34 R15.2
S_UP  (via drill 0.3)
  Top 0.254: v10.5,30.94 9.33,30.94 9.06,31.21 IC3.15
  Route2 0.254: v11.76,16.02 11.57,16.21 11.57,19.99 12.48,20.9 12.48,22.17 11.72,22.93 11.72,29.69 10.5,30.91 v10.5,30.94
  Bottom 0.254: R8.1 13.98,14.59 13.9,14.67 13.11,14.67 v11.76,16.02
SCL  (via drill 0.3)
  Top 0.203: v13.64,30.48 13.64,30.78 14.29,31.43 14.29,33 13.6,33.69 12,33.69 11.3,32.99 IC3.18
  Route2 0.203: v13.64,30.48 12.67,30.48 11.11,32.05 10.07,32.05 9.57,31.55 5.43,31.55 v5.24,31.74
  Bottom 0.305: R1.1 5.57,35.35 5.38,35.16 U$30.D0 5.38,32 5.24,31.87 v5.24,31.74
SDA  (via drill 0.3)
  Top 0.203: v13.6,32.04 13.15,32.49 IC3.17
  Route2 0.203: v4.33,35.86 4.35,35.84 9.81,35.84 v13.6,32.04
  Bottom 0.203: R2.1
  Bottom 0.305: U$30.D2 U$30.D1 4.73,35.46 v4.33,35.86 R2.1
SW2_TPS
  Top 0.203: U2.16 U2.15 7.75,6.59 8.39,5.95 8.49,5.85 8.5,5.83
  Top 0.305: U2.16 8.13,6.44 8.13,5.85 8.49,5.85 | U2.1 8.86,6.65 8.85,6.64 U2.1 | U2.1 9.48,7.31 9.81,6.98
  Top 0.508: U2.16 7.84,6.59 7.76,6.51 7.76,5.55 | 8.5,5.83 8.5,5.62 8.57,5.55
  Top 0.61: D3.A 8.95,4.98 8.13,5.8 8.13,6.44 | U2.16 8.19,6.64 8.85,6.64 | U2.1 8.86,6.42 8.39,5.95
  Top 1.016: 12.51,4.88 12.51,3.72 L2.2 11.82,4.33 10.4,4.33 10.4,4.94 D3.A
  pour Top (rank 2): 8.47,3.95 13.35,3.95 13.35,5.28 10.78,5.28 10.12,5.94 10.12,7.84 7.01,7.84 7.01,5.41
SWCLK  (via drill 0.3)
  Top 0.254: IC3.31 6.58,36.76 6.58,37.22 6.32,37.48 5.7,37.48 5.28,37.48 4.87,37.9 v4.79,37.9
  Route2 0.254: v4.79,37.9 5.76,36.92 11.43,36.92 13.56,34.79 v13.56,34.35
  GND 0.254: v13.56,34.35 13.56,33.05 14.46,32.16 14.46,18.66 12.47,16.67 12.47,15.92 12.48,15.91 12.48,15.14 13.38,14.24 15.01,14.24 15.11,14.14 15.11,2.98 v7.05,2.98
  Bottom 0.61: K2.6 6.75,3.3 7.05,3 v7.05,2.98
SWDIO  (via drill 0.3)
  Top 0.254: IC3.32 3.56,36.74 v2.6,35.79
  GND 0.254: v5.95,2.98 5.95,2.27 3.41,2.27 3.12,2.56 3.12,4.38 2.81,4.68 1.25,4.68 0.46,5.48 0.46,16.51 0.57,16.62 0.57,16.73 1.14,17.3 1.14,34.42 2.55,35.84 v2.6,35.79
  Bottom 0.61: v5.95,2.98 5.95,3.03 5.75,3.23 K2.7
VBAT_LCD
  Bottom 0.203: C25.1 11.38,26.13 11.38,29.11 11.33,29.17
  Bottom 0.305: C25.1 13.29,26.06 13.49,25.86 Q2.3 | U$30.VBAT 9.93,32.9 11.33,31.5 11.33,29.17
VBUS  (via drill 0.3)
  Top 0.254: 11.24,7.11 10.4,7.11 9.7,7.81 U2.2
  Top 0.305: v12.84,7.41 12.47,7.04 L2.1 | v11.77,21.46 11.77,19.68 C6.1
  Top 0.61: R14.1 9.54,22.98 10,22.52 10.39,22.52 U3.1
  Top 1.016: 12.76,8.54 12.71,8.59 12.57,8.45 12.45,8.57 C37.2 11.26,8.57 11.26,6.85 | 12.76,8.54 C9.1 C38.2 14.5,8.47 14.5,7.14 14.21,6.85 L2.1 | 12.76,8.54 12.76,7.14 L2.1 | L2.1 11.24,6.85 11.24,7.11
  Route2 0.254: v11.77,21.46 11.07,20.76 11.07,9.18
  Route2 0.305: 11.07,9.18 v12.84,7.41
  Bottom 0.305: Q2.2 12.86,23.1 R4.1 12.79,21.46 v11.77,21.46
  Bottom 0.61: v12.84,7.41 12.8,7.45 12.6,7.45 11.75,6.6 K2.1 11.75,3.45
  pour Top: 10.79,9.12 10.79,7.75 11.27,7.28 11.27,6.39 14.31,6.39 14.96,7.04 14.92,9.12
  pour Top: 8.66,23.66 10.89,23.66 11.02,23.53 11.02,22.36 11.34,22.04 14.51,22.12 14.51,19.05 14.16,18.69 12.78,18.69 12.44,18.35 10.08,18.35 9.77,18.66 9.77,21.95 9.46,22.26 8.67,22.26 8.56,22.37 8.56,23.6 8.58,23.62
VCC  (via drill 0.3)
  Top 0.203: IC3.30 7.06,37.8 6.7,38.16 v6.08,38.16 | 5.83,30.24 C3.1 5.86,30.46 v5.86,30.22 | R5.1 9.13,24.44 9.18,24.39
  Top 0.254: IC3.9 6.06,30.72
  Top 0.305: U1.5 6.4,26.67 6.72,26.99 8.58,26.99 8.98,26.59 Q1.2 8.97,26.07 8.97,24.44 R5.1 | U3.5 10.53,26.96 C8.1 10.93,27.36 C7.1 | 9.18,24.39 10.33,24.39 10.53,24.59 U3.5 | v9.9,18.44 9.73,18.61 D1.2 | v9.76,25.6 10.22,25.14 10.5,25.14 U3.5 | U2.3 9.79,8.31 10.16,8.68 v10.16,8.92 | 6.06,30.72 C3.1
  Route2 0.305: v9.76,25.6 9.9,25.46
  GND 0.203: v6.08,38.16 6.08,37.95 6.48,37.55 6.48,31.39 5.86,30.77 v5.86,30.22
  Bottom 0.203: v10.16,8.92 10.58,9.34 R7.1
  Bottom 0.305: R12.1 3.14,22.83 4.2,23.9 9.3,23.9 9.76,24.36 v9.76,25.6 | R9.1 1,14.49 1.28,14.77 2.54,14.77 3.69,15.92 3.69,17.8 4.1,18.21 5.93,18.21 6.16,17.97 9.43,17.97 v9.9,18.44
  pour Route2 (isolate 0.254, rank 2): -4.81,39.14 13.26,39.14 16.01,36.39 16.01,-1.73 -4.81,-1.73
VCC_2  (via drill 0.3)
  Top 0.305: C26.1 10.38,29.88 10.03,29.54 10.03,28.32 9.92,28.21 v9.92,28.19 9.81,28.08 Q1.3
  Bottom 0.203: R2.2 2.86,37.02 1.93,36.09 1.93,35.46 1.27,34.8 C22.1 | R1.2 5.77,36.98 6.14,37.35 R6.2 | U$30.VDD 8.63,32.48 9.39,31.72 9.39,29.77 9.94,29.21 9.94,28.21
  Bottom 0.305: R2.2 5.53,37.02 R1.2 | U$30.VDD 8.63,35.3 8.77,35.44 | U$30.BS1 7.98,35.34 8.08,35.44 8.77,35.44 | 8.77,35.44 9.46,35.44 9.79,35.77 9.79,38.13 9.59,38.34 7.17,38.34 6.94,38.11 R6.2 | C10.1 8.71,26.98 v9.92,28.19 9.94,28.21
VCC_OLED
  Bottom 0.305: U$30.VCC 2.78,32.86 3.28,32.36 3.28,27.46 | C5.1 3.28,27.46 | C21.1 3.28,26.21 3.28,27.46
VCOMH
  Bottom 0.305: U$30.VCOMH 3.43,32.93 3.8,32.55 3.8,27.05 4.11,26.74 4.11,24.69 3.92,24.5 C20.1
VINSENSE  (via drill 0.3)
  Top 0.203: IC3.4 3.52,34.49 2.4,33.37 v2.01,33.37 | v7.67,20.8 7.78,20.92 7.78,20.96 7.83,21.01
  Top 0.61: C28.1 7.83,20.1 7.83,21.01 R17.2 7.83,22.97 R14.2
  Route2 0.203: v7.67,20.8 8.1,21.24 8.1,28.2 7.48,28.82 5.68,28.82 3.12,31.38 3.12,32.68 2.43,33.37 v2.01,33.37
VOUT+  (via drill 0.3)
  Top 0.61: Q5.3 2.01,13.25 3.14,13.25 3.21,13.32 v3.38,13.32 3.38,13.46 4.38,14.46 R24.1
  Route2 0.305: v3.87,2.96 3.87,2.27 7.57,2.27 7.84,2.54 7.84,3.41 7.34,3.91 5.16,3.91 3.08,5.99 3.08,13.02 v3.38,13.32
  Bottom 0.61: v3.87,2.96 3.75,3.08 K2.9
VOUT-  (via drill 0.3)
  Top 0.305: v1.96,19.54 1.65,19.85 1.65,22.67 RSENSE.2
  Top 0.508: U1.3 3.81,22.55 3.47,22.21
  Route2 0.305: v1.96,19.54 2.38,19.54 3.09,18.83 3.09,15.38 2.57,14.86 2.57,5.72 4.87,3.42 v4.87,2.98
  Bottom 0.61: K2.8 4.75,3.08 v4.85,2.98 v4.87,2.98
  pour Top: 0.76,23.18 4.33,23.18 4.36,23.15 4.36,21.49 2.24,19.37 0.8,19.37 0.69,19.48 0.69,23.08
VOUTSENSE  (via drill 0.3)
  Top 0.254: D1.3 6.48,17.37 v6.48,16.34 | v2.42,32.21 2.72,32.21 4.5,33.99 IC3.5
  Top 0.61: R24.2 6.52,14.46 | C19.1 7.21,14.41 6.57,14.41 6.52,14.46 | 6.52,14.46 6.34,14.64 R25.1 6.34,17.82 6.48,17.96 D1.3
  Route2 0.203: v2.42,32.21 2.42,31.5 5.52,28.39 7.32,28.39 7.69,28.02 7.69,21.87 6.97,21.15 6.97,21.09
  Route2 0.254: 6.97,21.09 6.97,16.83 v6.48,16.34
VSOURCE
  Top 1.016: D3.C 6.57,4.89 6,4.89 5.44,4.33 3.56,4.33 2.74,5.15 C41.1 2.74,5.79 C4.1
  pour Top: 4.01,5.2 7.06,5.2 7.06,3.5 1.68,3.5 0.41,4.77 0.41,8.86 0.47,8.92 0.48,8.92 1.57,10.01 1.57,10.83 2.72,11.98 6.84,11.98 6.84,10.43 6.38,9.97 4.35,9.97 3.53,9.15 3.53,5.68
(copper drawn outside any net)
  shapes: Bottom area x2

### Text on the board
bNames: BATT_CPU / rover R-1 / v6-Sep'24